# Altium schematic sheet FireFly.SchDoc: TEBF0808 - FireFly
size A4; PageSetup: Record=PageOptions|CenterHorizontal=True|CenterVertical=True|PrintScale=0.96|XCorrection=1.00|YCorrection=1.00|PrintKind=0|BorderSize=5000000|LeftOffset=0|BottomOffset=0|Orientation=2|PaperLength=1000|PaperWidth=1000|Scale=100|PaperSource=7|PrintQuality=-4|MediaType=1|DitherType=10|PaperKind=A4|PrintScaleMode=1; Organization: Trenz Electronic GmbH; DocumentNumber: TEBF0808; Revision: 04; SheetNumber: 28; SheetTotal: 36; Date: 2016-09-29; CompanyName: Trenz Electronic GmbH
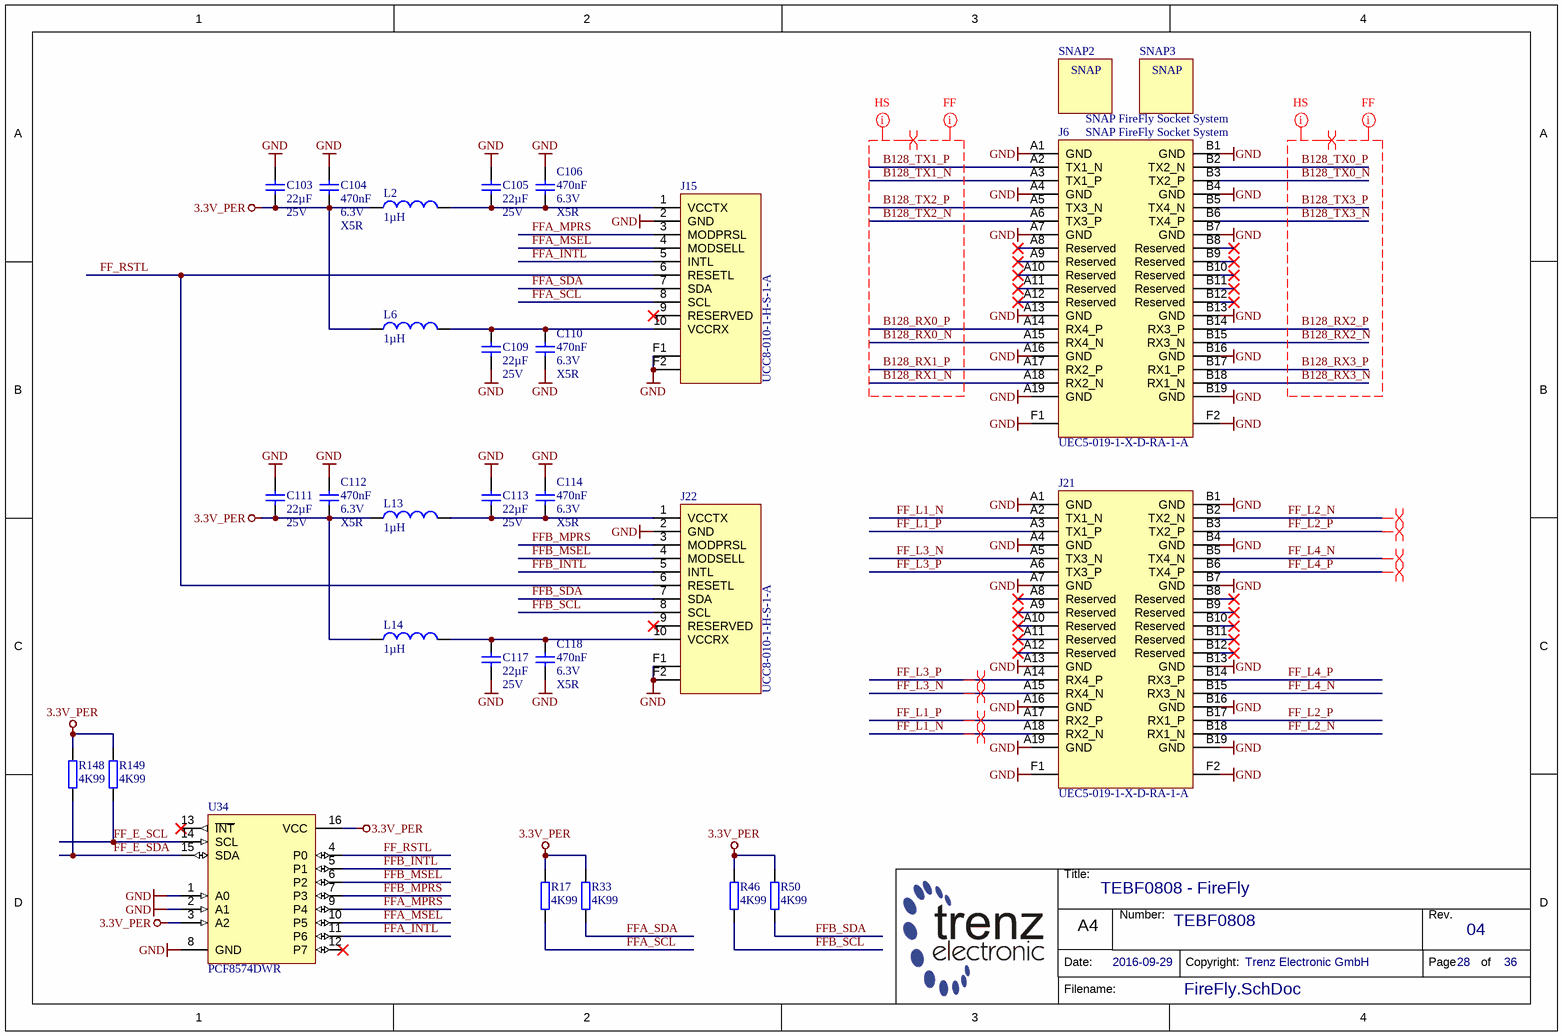
[diagram p0: FireFly.SchDoc]

## Parts
C103  22µF  Voltage: 25V  [CAPC3216X180N]
C104  470nF  Voltage: 6.3V  Technology: X5R  [CAPC1005X55N]
C105  22µF  Voltage: 25V  [CAPC3216X180N]
C106  470nF  Voltage: 6.3V  Technology: X5R  [CAPC1005X55N]
C109  22µF  Voltage: 25V  [CAPC3216X180N]
C110  470nF  Voltage: 6.3V  Technology: X5R  [CAPC1005X55N]
C111  22µF  Voltage: 25V  [CAPC3216X180N]
C112  470nF  Voltage: 6.3V  Technology: X5R  [CAPC1005X55N]
C113  22µF  Voltage: 25V  [CAPC3216X180N]
C114  470nF  Voltage: 6.3V  Technology: X5R  [CAPC1005X55N]
C117  22µF  Voltage: 25V  [CAPC3216X180N]
C118  470nF  Voltage: 6.3V  Technology: X5R  [CAPC1005X55N]
J6  UEC5-019-1-X-D-RA-1-A  [UEC5-019-1-X-D-RA-1-A]
J15  UCC8-010-1-H-S-1-A  [UCC8-010-1-X-S-1-A]
J21  UEC5-019-1-X-D-RA-1-A  [UEC5-019-1-X-D-RA-1-A]
J22  UCC8-010-1-H-S-1-A  [UCC8-010-1-X-S-1-A]
L2  1µH  [INDC2520X100N]
L6  1µH  [INDC2520X100N]
L13  1µH  [INDC2520X100N]
L14  1µH  [INDC2520X100N]
R17  4K99  [RESC1005X40N]
R33  4K99  [RESC1005X40N]
R46  4K99  [RESC1005X40N]
R50  4K99  [RESC1005X40N]
R148  4K99  [RESC1005X40N]
R149  4K99  [RESC1005X40N]
SNAP2  SNAP FireFly Socket System  [FireFly_Snap]  (no BOM)
SNAP3  SNAP FireFly Socket System  [FireFly_Snap]  (no BOM)
U34  PCF8574DWR  [SOIC127P1030X265-16N]

## Nets
3.3V_PER: C103.2 C104.2 C111.2 C112.2 L2.1 L6.1 L13.1 L14.1 R17.1 R33.1 R46.1 R50.1 R148.1 R149.1 U34.3(A2) U34.16(VCC)
GND: C103.1 C104.1 C105.2 C106.1 C109.1 C110.2 C111.1 C112.1 C113.2 C114.1 C117.1 C118.2 J6.A1(GND) J6.A4(GND) J6.A7(GND) J6.A13(GND) J6.A16(GND) J6.A19(GND) J6.B1(GND) J6.B4(GND) J6.B7(GND) J6.B13(GND) J6.B16(GND) J6.B19(GND) J6.F1(GND) J6.F2(GND) J15.2(GND) J15.F1(GND) J15.F2(GND) J21.A1(GND) J21.A4(GND) J21.A7(GND) J21.A13(GND) J21.A16(GND) J21.A19(GND) J21.B1(GND) J21.B4(GND) J21.B7(GND) J21.B13(GND) J21.B16(GND) J21.B19(GND) J21.F1(GND) J21.F2(GND) J22.2(GND) J22.F1(GND) J22.F2(GND) U34.1(A0) U34.2(A1) U34.8(GND)
B128_RX0_N: J6.A15(RX4_N)
B128_RX0_P: J6.A14(RX4_P)
B128_RX1_N: J6.A18(RX2_N)
B128_RX1_P: J6.A17(RX2_P)
B128_RX2_N: J6.B15(RX3_N)
B128_RX2_P: J6.B14(RX3_P)
B128_RX3_N: J6.B18(RX1_N)
B128_RX3_P: J6.B17(RX1_P)
B128_TX0_N: J6.B3(TX2_P)
B128_TX0_P: J6.B2(TX2_N)
B128_TX1_N: J6.A3(TX1_P)
B128_TX1_P: J6.A2(TX1_N)
B128_TX2_N: J6.A6(TX3_P)
B128_TX2_P: J6.A5(TX3_N)
B128_TX3_N: J6.B6(TX4_P)
B128_TX3_P: J6.B5(TX4_N)
FF_E_SCL: R149.2 U34.14(SCL)
FF_E_SDA: R148.2 U34.15(SDA)
FF_L1_N: J21.A2(TX1_N) J21.A18(RX2_N)
FF_L1_P: J21.A3(TX1_P) J21.A17(RX2_P)
FF_L2_N: J21.B2(TX2_N) J21.B18(RX1_N)
FF_L2_P: J21.B3(TX2_P) J21.B17(RX1_P)
FF_L3_N: J21.A5(TX3_N) J21.A15(RX4_N)
FF_L3_P: J21.A6(TX3_P) J21.A14(RX4_P)
FF_L4_N: J21.B5(TX4_N) J21.B15(RX3_N)
FF_L4_P: J21.B6(TX4_P) J21.B14(RX3_P)
FF_RSTL: J15.6(RESETL) J22.6(RESETL) U34.4(P0)
FFA_INTL: J15.5(INTL) U34.11(P6)
FFA_MPRS: J15.3(MODPRSL) U34.9(P4)
FFA_MSEL: J15.4(MODSELL) U34.10(P5)
FFA_SCL: J15.8(SCL) R17.2
FFA_SDA: J15.7(SDA) R33.2
FFB_INTL: J22.5(INTL) U34.5(P1)
FFB_MPRS: J22.3(MODPRSL) U34.7(P3)
FFB_MSEL: J22.4(MODSELL) U34.6(P2)
FFB_SCL: J22.8(SCL) R46.2
FFB_SDA: J22.7(SDA) R50.2
NetC105_1: C105.1 C106.2 J15.1(VCCTX) L2.2
NetC109_2: C109.2 C110.1 J15.10(VCCRX) L6.2
NetC113_1: C113.1 C114.2 J22.1(VCCTX) L13.2
NetC117_2: C117.2 C118.1 J22.10(VCCRX) L14.2

Not connected (* = marked no-connect by the designer): J6 A8(Reserved)* A9(Reserved)* A10(Reserved)* A11(Reserved)* A12(Reserved)* B8(Reserved)* B9(Reserved)* B10(Reserved)* B11(Reserved)* B12(Reserved)*; J15 9(RESERVED)*; J21 A8(Reserved)* A9(Reserved)* A10(Reserved)* A11(Reserved)* A12(Reserved)* B8(Reserved)* B9(Reserved)* B10(Reserved)* B11(Reserved)* B12(Reserved)*; J22 9(RESERVED)*; U34 12(P7)* 13(~{INT})*

## Layout directives
differential pair: B128_RX0_N, B128_RX0_P, B128_RX1_N, B128_RX1_P, B128_RX2_N, B128_RX2_P, B128_RX3_N, B128_RX3_P, B128_TX0_N, B128_TX0_P, B128_TX1_N, B128_TX1_P, B128_TX2_N, B128_TX2_P, B128_TX3_N, B128_TX3_P, FF_L1_N, FF_L1_P, FF_L2_N, FF_L2_P, FF_L3_N, FF_L3_P, FF_L4_N, FF_L4_P
net class HS: B128_RX0_N, B128_RX0_P, B128_RX1_N, B128_RX1_P, B128_RX2_N, B128_RX2_P, B128_RX3_N, B128_RX3_P, B128_TX0_N, B128_TX0_P, B128_TX1_N, B128_TX1_P, B128_TX2_N, B128_TX2_P, B128_TX3_N, B128_TX3_P
net class FF: B128_RX0_N, B128_RX0_P, B128_RX1_N, B128_RX1_P, B128_RX2_N, B128_RX2_P, B128_RX3_N, B128_RX3_P, B128_TX0_N, B128_TX0_P, B128_TX1_N, B128_TX1_P, B128_TX2_N, B128_TX2_P, B128_TX3_N, B128_TX3_P

## Notes on the sheet
- Title:
- Number:
- Rev.
- Date:
- A4
- Copyright:
- Page
- of
- Filename:
- (in symbol 27358) SNAP

## Library data of the parts
C103 C105 C109 C111 C113 C117 = 24886: KON 22µF X5R 25V SMD 10%; AN: 24886; Value: 22u; Mixed: SMT; Preferred: Yes; Case: 3216 (1206); Tolerance: 10%
C104 C106 C110 C112 C114 C118 = 23659: KON 470nF 6,3V X5R SMD; AN: 23659; Value: 470n; Mixed: SMT; Preferred: Yes; Case: 1005 (0402)
J6 J21 = 27355: UEC5-019-1-H-D-RA-1-A; AN: 27355; Mixed: SMT; Case: UEC5; HelpURL: B:\AD\adlib\datasheet\UEC5_UCC8; H-ART: UEC5-019-1-H-D-RA-1-A
J15 J22 = 27354: AN: 27354; Mixed: SMT; Case: UCC8; HelpURL: B:\AD\adlib\datasheet\UEC5_UCC8; H-ART: UCC8-010-1-H-S-1-A
L2 L6 L13 L14 = 25265: IND SMD 1µH +-20% 0.055Ohm; AN: 25265; Value: 1u; Trenz-Stock: Yes; Voltage: 1.7A; Mixed: SMT; H-ART: 74479787210a; Case: WE-PMI 2520(1008); HelpURL: B:\AD\adlib\datasheet\74479787210a; Technology: 0.055Ohm
R17 R33 R46 R50 R148 R149 = 22754: WID SMD 4K99 1% 0,063W; AN: 22754; Value: 4.99K; Mixed: SMT; Preferred: Yes; Case: 1005 (0402); Tolerance: 1%; Technology: TK100
SNAP2 SNAP3 = 27358: AN: 27358; Mixed: SMT
U34 = 26502: AN: 26502; Mixed: SMT; Case: SO16W DW; HelpURL: B:\AD\adlib\datasheet\PCF8574; H-ART: PCF8574DWR